# Altium schematic sheet Sheet1.SchDoc
size A2; SheetNumber: 1; SheetTotal: 1
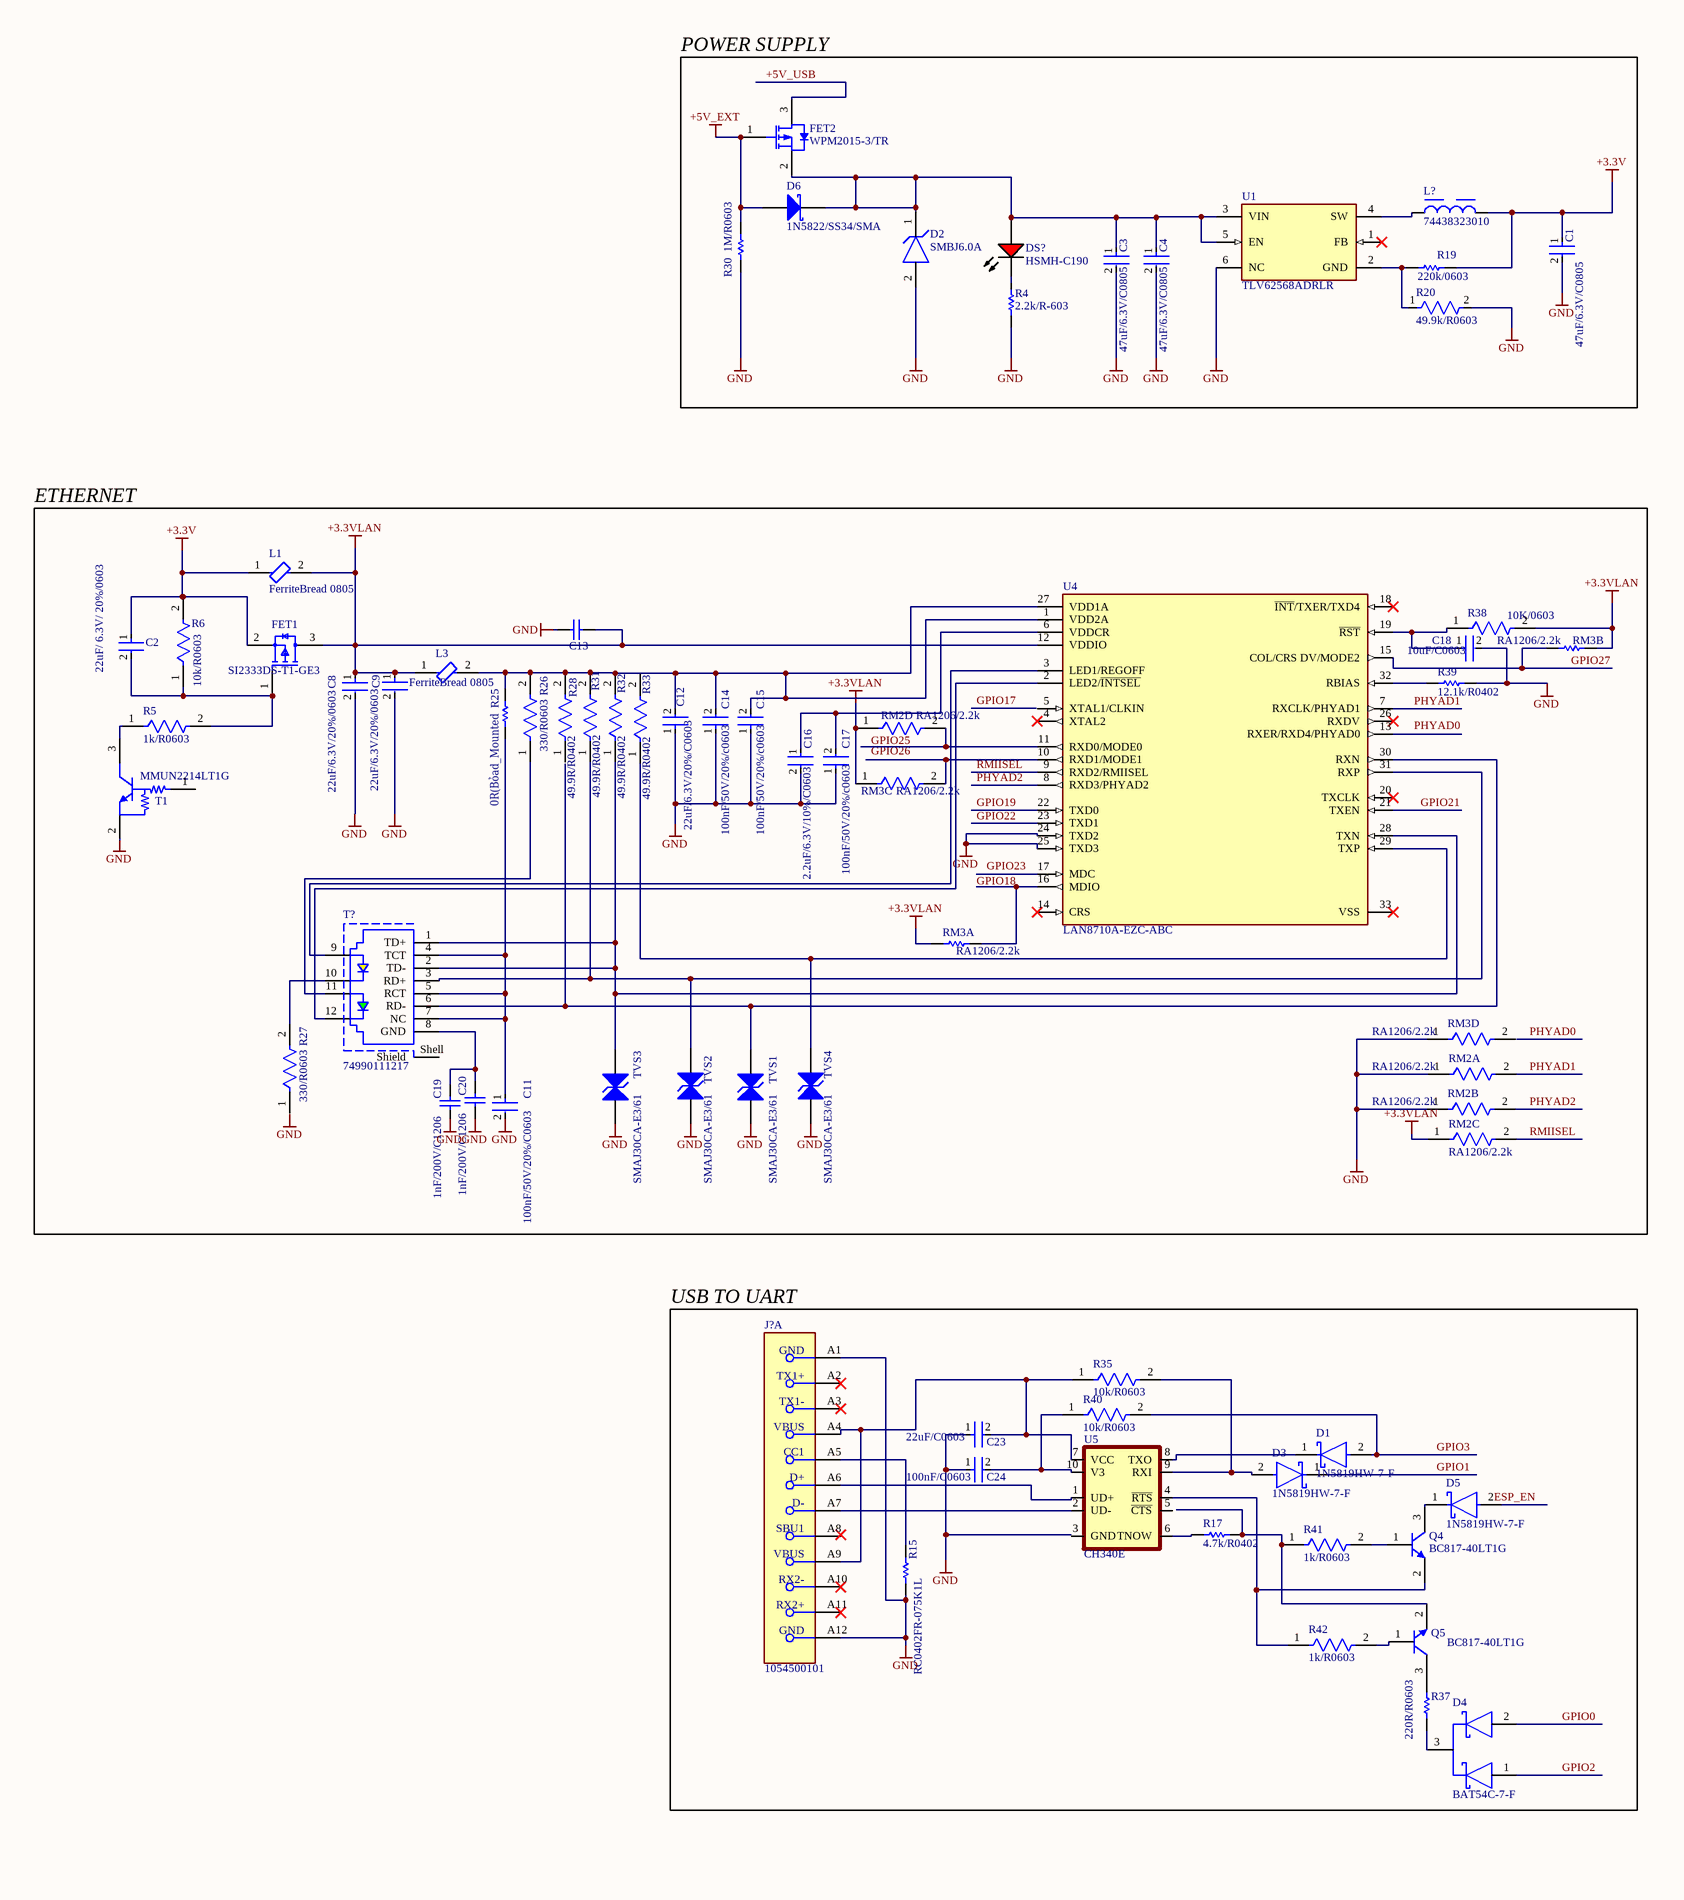
[diagram p0: Sheet1.SchDoc, left]
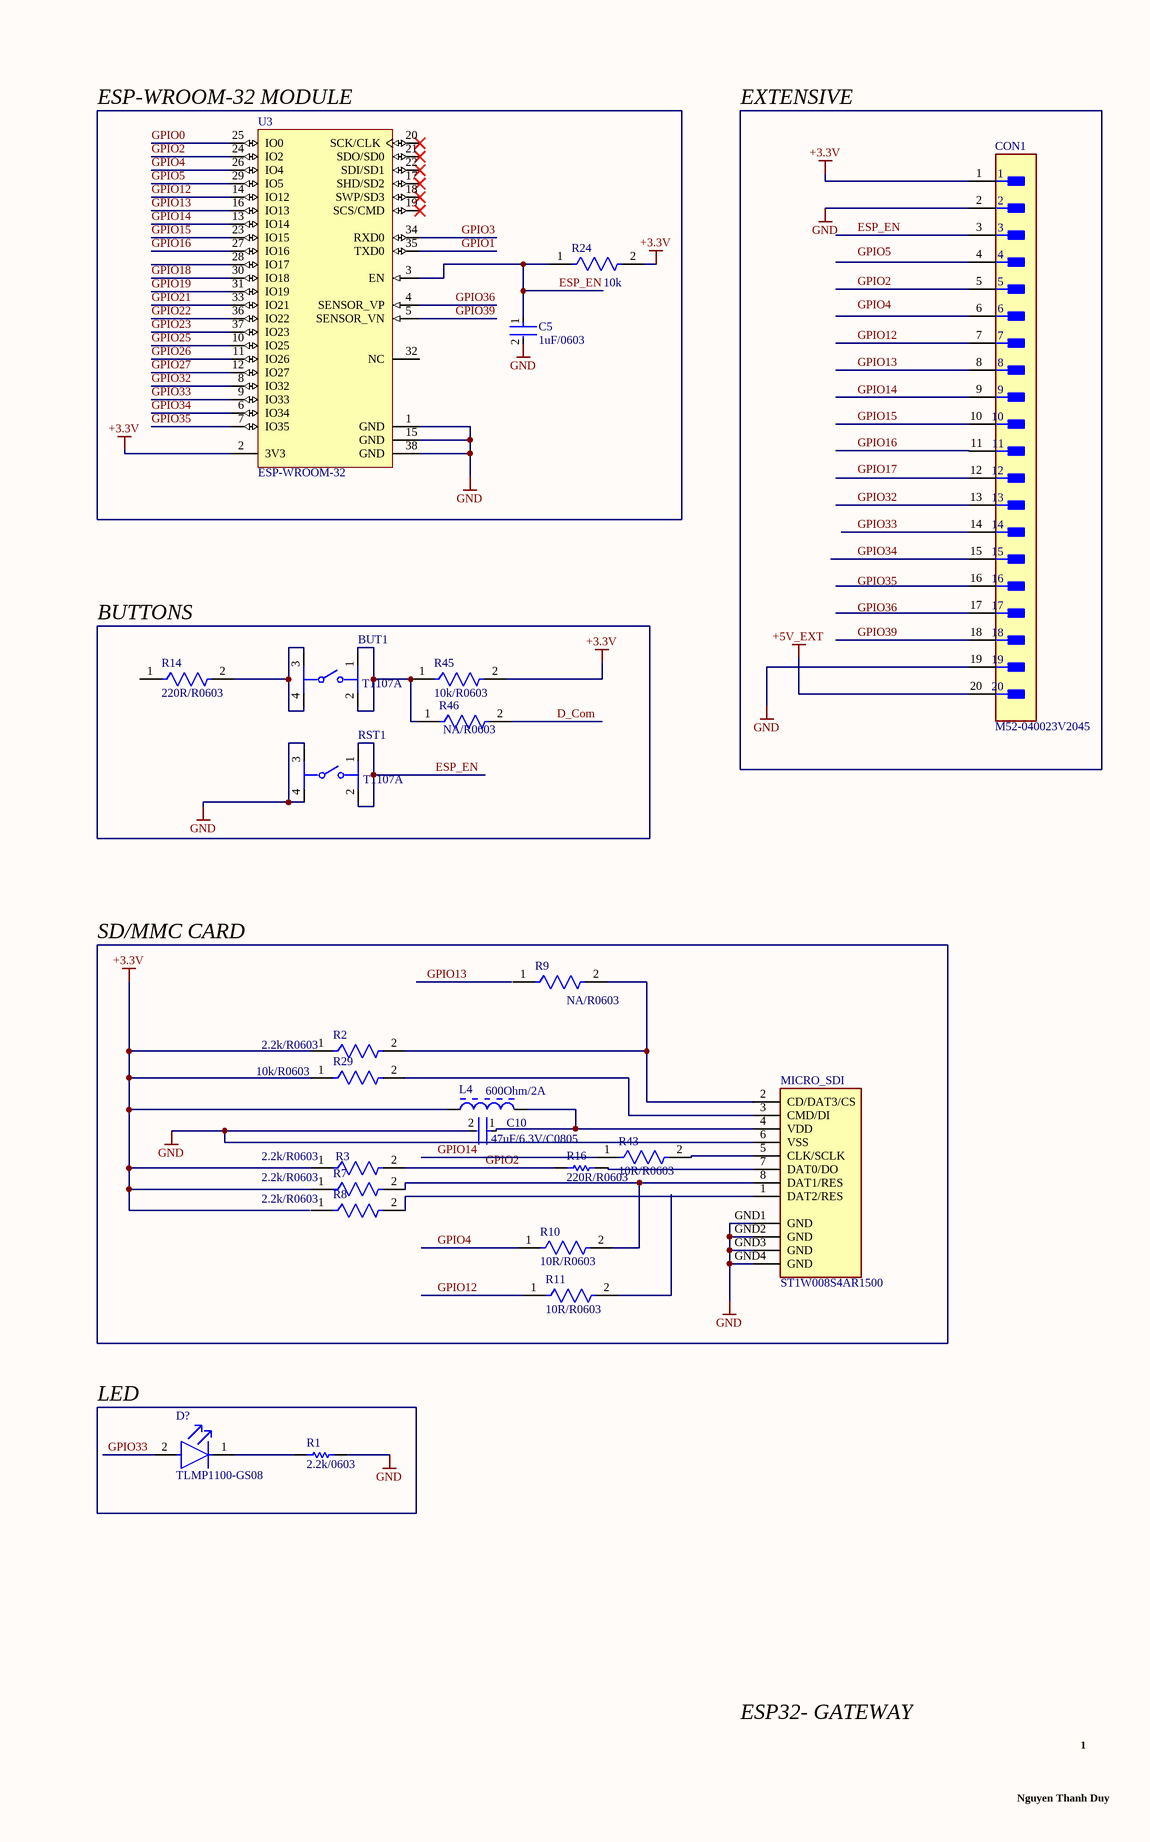
[diagram p1: Sheet1.SchDoc, right]

## Parts
BUT1  T1107A  [FP-PTS645SM43SMTR92LFS-MFG]
C1  47uF/6.3V/C0805  [FP-C0805C476M9PACTU-MFG]
C2  22uF/ 6.3V/ 20%/0603  [FP-GRM21B-0_15-MFG]
C3  47uF/6.3V/C0805  [FP-C0805C476M9PACTU-MFG]
C4  47uF/6.3V/C0805  [FP-C0805C476M9PACTU-MFG]
C5  1uF/0603  [FP-CC0603-DA-MFG]
C8  22uF/6.3V/20%/0603  [FP-GRM188-0_2-IPC_C]
C9  22uF/6.3V/20%/0603  [FP-GRM188-0_2-IPC_C]
C10  47uF/6.3V/C0805  [FP-C0805C476M9PACTU-MFG]
C11  100nF/50V/20%/C0603  [FP-CGA3E-0_3-0_1-IPC_B]
C12  22uF/6.3V/20%/C0603  [FP-GRM188-0_2-IPC_C]
C13  GRM188R71H104KA93D  [CAPC1608X90X35ML10T15]  (value not drawn)
C14  100nF/50V/20%/c0603  [FP-CGA3E-0_3-0_1-IPC_B]
C15  100nF/50V/20%/c0603  [FP-CGA3E-0_3-0_1-IPC_B]
C16  2.2uF/6.3V/10%/C0603  [FP-C0603C225K4PACTU-MFG]
C17  100nF/50V/20%/c0603  [FP-CGA3E-0_3-0_1-IPC_B]
C18  10uF/C0603  [FP-0603-L_1_6_0_15-W_0_81-IPC_C]
C19  1nF/200V/C1206  [AVX-12065C102KAT2A_L]
C20  1nF/200V/C1206  [AVX-12065C102KAT2A_L]
C23  22uF/C0603  [FP-GRM188-0_2-IPC_C]
C24  100nF/C0603  [FP-CGA3E-0_3-0_1-IPC_B]
CON1  M52-040023V2045  [FP-M52-040023V2045-MFG]
D1  1N5819HW-7-F  [FP-SOD123-IPC_A]
D2  SMBJ6.0A  [FP-SMB-MFG]
D3  1N5819HW-7-F  [FP-SOD123-IPC_A]
D4  BAT54C-7-F  [FP-SOT23-IPC_B]
D5  1N5819HW-7-F  [FP-SOD123-IPC_A]
D6  1N5822/SS34/SMA  [MCSM-D-5B-2_L]
D?  TLMP1100-GS08  [FP-6_541-5056_01-4-MFG]
DS?  HSMH-C190  [AVAG-HSMX-C190_V]
FET1  SI2333DS-T1-GE3  [FP-S-03946-MFG]
FET2  WPM2015-3/TR  [AO-SOT-23-3L_V]
J?  1054500101  [FP-1054500101-MFG]  (part A of 3)
L1  FerriteBread 0805  [FP-BLM21-0_2-t0_85-e0_5-d-MFG]
L3  FerriteBread 0805  [FP-BLM21-0_2-t0_85-e0_5-d-MFG]
L4  600Ohm/2A  [LIRD-MI0805K601R-10-2_V]
L?  74438323010  [WE-MAPI_2510]
MICRO_SDI  ST1W008S4AR1500  [JAE_ST1W008S4AR1500]
Q4  BC817-40LT1G  [ONSC-SOT-23-3-318-08_V]
Q5  BC817-40LT1G  [ONSC-SOT-23-3-318-08_V]
R1  2.2k/0603  [RESC1608X55X25LL10T15]
R2  2.2k/R0603  [FP-RC0603-0_55-IPC_C]
R3  2.2k/R0603  [FP-RC0603-0_55-IPC_C]
R4  2.2k/R-603  [RESC1608X55X25LL10T15]
R5  1k/R0603  [FP-ERJ3G-MFG]
R6  10k/R0603  [FP-RC0603-0_55-MFG]
R7  2.2k/R0603  [FP-RC0603-0_55-IPC_C]
R8  2.2k/R0603  [FP-RC0603-0_55-IPC_C]
R9  NA/R0603  [FP-RC0603-0_55-IPC_C]
R10  10R/R0603  [FP-ERJ3EK-MFG]
R11  10R/R0603  [FP-ERJ3EK-MFG]
R14  220R/R0603  [FP-CR0603-MFG]
R15  RC0402FR-075K1L  [RESC1005X40X25NL05T10]
R16  220R/R0603  [RESC1608X55X25LL10T15]
R17  4.7k/R0402  [RESC1005X40X25ML05T05]
R19  220k/0603  [RESC1608X55X25ML10T15]
R20  49.9k/R0603  [FP-ERA6A_L]
R24  10k  [FP-RC0603-0_55-IPC_C]
R25  0R(Bỏad_Mounted  [RESC1005X40X25NL05T10]
R26  330/R0603  [FP-CR0603-IPC_A]
R27  330/R0603  [FP-CR0603-IPC_A]
R28  49.9R/R0402  [FP-ERJ2RK-MFG]
R29  10k/R0603  [FP-RC0603-0_55-IPC_C]
R30  1M/R0603  [RESC1608X55X25ML10T15]
R31  49.9R/R0402  [FP-ERJ2RK-MFG]
R32  49.9R/R0402  [FP-ERJ2RK-MFG]
R33  49.9R/R0402  [FP-ERJ2RK-MFG]
R35  10k/R0603  [FP-RC0603-0_55-MFG]
R37  220R/R0603  [RESC1608X55X25ML10T15]
R38  10K/0603  [FP-RC0603-0_55-MFG]
R39  12.1k/R0402  [RESC1005X40X25LL05T05]
R40  10k/R0603  [FP-RC0603-0_55-MFG]
R41  1k/R0603  [FP-ERA3A-IPC_C]
R42  1k/R0603  [FP-ERA3A-IPC_C]
R43  10R/R0603  [FP-ERJ3EK-MFG]
R45  10k/R0603  [FP-RC0603-0_55-IPC_C]
R46  NA/R0603  [FP-RC0603-0_55-IPC_C]
RM2A  RA1206/2.2k  [FP-AC1206-MFG]
RM2B  RA1206/2.2k  [FP-AC1206-MFG]
RM2C  RA1206/2.2k  [FP-AC1206-MFG]
RM2D  RA1206/2.2k  [FP-AC1206-MFG]
RM3A  RA1206/2.2k  [RESC3116X65X40ML10T20]
RM3B  RA1206/2.2k  [RESC3116X65X40ML10T20]
RM3C  RA1206/2.2k  [FP-AC1206-MFG]
RM3D  RA1206/2.2k  [FP-AC1206-MFG]
RST1  T1107A  [FP-PTS645SM43SMTR92LFS-MFG]
T1  MMUN2214LT1G  [ONSC-SOT-23-3-318-08_V]
T?  74990111217  [74990111217]
TVS1  SMAJ30CA-E3/61  [VISH-DO-214AC-2_L]
TVS2  SMAJ30CA-E3/61  [VISH-DO-214AC-2_L]
TVS3  SMAJ30CA-E3/61  [VISH-DO-214AC-2_L]
TVS4  SMAJ30CA-E3/61  [VISH-DO-214AC-2_L]
U1  TLV62568ADRLR  [FP-DRL0006A-MFG]
U3  ESP-WROOM-32  [OLMX-ESP-WROOM-32]
U4  LAN8710A-EZC-ABC  [FP-32-SQFN-5x5B-0_5P-MFG]
U5  CH340E  [MSOP10]

## Blocks framed on the sheet
POWER SUPPLY: C1 C3 C4 D2 D6 DS? FET2 L? R4 R19 R20 R30 U1
ETHERNET: C2 C8 C9 C11-C20 FET1 L1 L3 R5 R6 R25-R28 R31-R33 R38 R39 RM2A RM2B RM2C RM2D RM3A RM3B RM3C RM3D T1 T? TVS1-TVS4 U4

## Nets
+3.3V: C1.1 C2.1 CON1.1 FET1.2(S) L1.1 L4.1 L?.2 R2.1 R3.1 R6.2 R7.1 R19.2 R24.2 R29.1 R45.2 U3.2(3V3)
+3.3VLAN: C8.1 C9.1 C13.2 FET1.3(D) L1.2 L3.1 R38.2 RM2C.1 RM2D.1 RM3A.1 RM3B.2 RM3C.1 U4.12(VDDIO)
+5V_EXT: CON1.20 D6.1(A) FET2.1(GATE) R30.2
GND: C1.2 C3.2 C4.2 C5.2 C8.2 C9.2 C10.2 C11.2 C12.1 C13.1 C14.1 C15.1 C16.2 C17.1 C18.2 C20.1 C23.1 C24.1 CON1.2 CON1.19 D2.2(A) J?.A1(GND) J?.A12(GND) MICRO_SDI.6(VSS) MICRO_SDI.GND1(GND) MICRO_SDI.GND2(GND) MICRO_SDI.GND3(GND) MICRO_SDI.GND4(GND) R1.2 R4.1 R15.1 R20.2 R30.1 R39.2 RM2A.1 RM2B.1 RM3D.1 RST1.3 RST1.4 T1.2(E) TVS2.1(A1) TVS4.1(A1) U1.6(NC) U3.1(GND) U3.15(GND) U3.38(GND) U4.24(TXD2) U4.25(TXD3)
+5V_USB: FET2.3(DRAIN)
D_Com: R46.2
ESP_EN: C5.1 CON1.3 D5.2(A) R24.1 RST1.1 RST1.2 U3.3(EN)
GPIO0: D4.2(2_ANODE) U3.25(IO0)
GPIO1: D3.1(C) U3.35(TXD0)
GPIO2: CON1.5 D4.1(1_ANODE) R3.2 R16.1 U3.24(IO2)
GPIO3: D1.2(A) R40.2 U3.34(RXD0)
GPIO4: R10.1 U3.26(IO4)
GPIO5: U3.29(IO5)
GPIO12: CON1.7 R11.1 U3.14(IO12)
GPIO13: CON1.8 U3.16(IO13)
GPIO14: CON1.9 R43.1 U3.13(IO14)
GPIO15: CON1.10 U3.23(IO15)
GPIO16: CON1.11 U3.27(IO16)
GPIO18: U3.30(IO18)
GPIO19: U3.31(IO19) U4.22(TXD0)
GPIO21: U3.33(IO21) U4.21(TXEN)
GPIO22: U3.36(IO22) U4.23(TXD1)
GPIO23: U3.37(IO23) U4.17(MDC)
GPIO25: U3.10(IO25)
GPIO26: U3.11(IO26)
GPIO27: RM3B.1 U3.12(IO27) U4.15(COL/CRS_DV/MODE2)
GPIO32: CON1.13 U3.8(IO32)
GPIO33: CON1.14 D?.2(A) U3.9(IO33)
GPIO34: CON1.15 U3.6(IO34)
GPIO35: U3.7(IO35)
GPIO36: U3.4(SENSOR_VP)
GPIO39: CON1.18 U3.5(SENSOR_VN)
PHYAD1: RM2A.2 U4.7(RXCLK/PHYAD1)
PHYAD2: RM2B.2 U4.8(RXD3/PHYAD2)
RMIISEL: RM2C.2 U4.9(RXD2/RMIISEL)
NetBUT1_1: BUT1.1 BUT1.2 R45.1 R46.1
NetBUT1_3: BUT1.3 BUT1.4 R14.2
NetC2_2: C2.2 FET1.1(G) R5.2 R6.1
NetC3_1: C3.1 C4.1 D2.1(C) D6.2(K) DS?.1(A) FET2.2(SOURCE) U1.3(VIN) U1.5(EN)
NetC10_1: C10.1 L4.2 MICRO_SDI.4(VDD)
NetC11_1: C11.1 R25.1 T?.4(TCT) T?.5(RCT) T?.7(NC)
NetC12_2: C12.2 C14.2 C15.2 L3.2 R25.2 R26.2 R28.2 R31.2 R32.2 U4.1(VDD2A) U4.27(VDD1A)
NetC16_1: C16.1 C17.2 U4.6(VDDCR)
NetC18_1: C18.1 R38.1 U4.19(~{RST})
NetC19_2: C19.2 C20.2 T?.8(GND)
NetC23_2: C23.2 J?.A4(VBUS) J?.A9(VBUS) R35.1 U5.7(VCC)
NetC24_2: C24.2 R40.1 U5.10(V3)
NetD1_1: D1.1(C) U5.8(TXO)
NetD3_2: D3.2(A) R35.2 U5.9(RXI)
NetD4_3: D4.3(COMMON_CATHODE) R37.1
NetD5_1: D5.1(C) Q4.3(C)
NetD?_1: D?.1(C) R1.1
NetDS?_2: DS?.2(K) R4.2
NetJ?_A5: J?.A5(CC1) R15.2
NetJ?_A6: J?.A6(D+) U5.1(UD+)
NetJ?_A7: J?.A7(D-) U5.2(UD-)
NetL?_1: L?.1 U1.4(SW)
NetMICRO_SDI_1: MICRO_SDI.1(DAT2/RES) R8.2
NetMICRO_SDI_2: MICRO_SDI.2(CD/DAT3/CS) R2.2 R9.2
NetMICRO_SDI_3: MICRO_SDI.3(CMD/DI) R29.2
NetMICRO_SDI_5: MICRO_SDI.5(CLK/SCLK) R43.2
NetMICRO_SDI_7: MICRO_SDI.7(DAT0/DO) R16.2
NetMICRO_SDI_8: MICRO_SDI.8(DAT1/RES) R7.2 R10.2
NetQ4_1: Q4.1(B) R41.2
NetQ4_2: Q4.2(E) R42.1 U5.4(~{RTS})
NetQ5_1: Q5.1(B) R42.2
NetQ5_2: Q5.2(E) R17.2 R41.1
NetQ5_3: Q5.3(C) R37.2
NetR5_1: R5.1 T1.3(C)
NetR17_1: R17.1 U5.6(TNOW)
NetR19_1: R19.1 R20.1 U1.2(GND)
NetR26_1: R26.1 T?.11
NetR27_2: R27.2 T?.10
NetR31_1: R31.1 T?.3(RD+) TVS2.2(A2) U4.31(RXP)
NetR32_1: R32.1 T?.1(TD+) T?.2(TD-) TVS3.2(A2) U4.28(TXN)
NetR33_1: R33.1 TVS4.2(A2) U4.29(TXP)
NetR39_1: R39.1 U4.32(RBIAS)
NetRM2D_2: RM2D.2 U4.11(RXD0/MODE0)
NetRM3A_2: RM3A.2 U4.16(MDIO)
NetRM3C_2: RM3C.2 U4.10(RXD1/MODE1)
NetT?_6: T?.6(RD-) TVS1.2(A2) U4.30(RXN)
NetT?_9: T?.9 U4.3(LED1/REGOFF)
NetT?_12: T?.12 U4.2(LED2/~{INTSEL})

Not connected (* = marked no-connect by the designer): C19 1; CON1 4 6 12 16 17; J? A2(TX1+)* A3(TX1-)* A8(SBU1) A10(RX2-)* A11(RX2+)*; R8 1; R9 1; R11 2; R14 1; R27 1; R28 1; R33 2; RM3D 2; T1 1(B); T? Shell(Shield); TVS1 1(A1); TVS3 1(A1); U1 1(FB)*; U3 17(SHD/SD2)* 18(SWP/SD3)* 19(SCS/CMD)* 20(SCK/CLK)* 21(SDO/SD0)* 22(SDI/SD1)* 28(IO17) 32(NC); U4 4(XTAL2)* 5(XTAL1/CLKIN) 13(RXER/RXD4/PHYAD0) 14(CRS)* 18(~{INT}/TXER/TXD4)* 20(TXCLK)* 26(RXDV)* 33(VSS)*; U5 3(GND) 5(~{CTS})

## Notes on the sheet
- (near U3) ESP-WROOM-32 MODULE
- EXTENSIVE
- (near R14) BUTTONS
- SD/MMC CARD
- USB TO UART
- LED
- ESP32- GATEWAY
- Nguyen Thanh Duy
- 1
- Labels drawn without touching a wire or pin: GND, GPIO4, GPIO5, GPIO17, GPIO18, GPIO25, GPIO26, GPIO35, GPIO36, PHYAD0

## Library data of the parts
BUT1 RST1 = CMP-2000-05160-2: SWITCH TACTILE SPST-NO 0.05A 12V; Contact Resistance: 100mR; Throw Configuration: SPST; Illumination Type: Non-Illuminated; Mechanical Life: 100000Cycles; Current Rating: 50mA; Switch Function: Off-Mom; Actuator Length: 0.85mm; Actuator Material: Nylon; Actuator Type: Standard; Operating Force: 160gf; Min Operating Temperature: -20°C; REACH SVHC: No SVHC; Termination: Gull Wing; Case/Package: SMD/SMT; Packaging: Tape and Reel; Mount: Surface Mount; Voltage Rating (DC): 12V; Orientation: Straight; Lead Free: Lead Free; Contact Material: Silver; Color: Black; Max Current Rating: 50mA; Contact Plating: Silver; Depth: 9mm; Package Quantity: 1; Max Voltage Rating (DC): 12V; Length: 6mm; Max Operating Temperature: 60°C
C1 C3 C4 C10 = CMP-2007-01008-2: CAP CER 47UF 6.3V X5R 0805; Dielectric Material: Ceramic; Dissipation Factor: 5%; Tolerance: 20%; Case Code (Imperial): 0805; Mount: PCB; Width: 1.2mm; Package Quantity: 3000; Radiation Hardening: No; Packaging: Tape and Reel; Termination: SMD/SMT; Series: C0805C; Voltage: 6.3V; Depth: 1.25mm; Dielectric: X5R; Case Code (Metric): 2012; Length: 2mm; Case/Package: 0805; REACH SVHC: No SVHC; Voltage Rating (DC): 6.3V; Capacitance: 47uF; RoHS Compliant: Yes; Height: 1.25mm; Construction: Flat; Number of Pins: 2; Voltage Rating: 6.3V; Max Operating Temperature: 85°C; Min Operating Temperature: -55°C
C2 = CMP-2007-03385-2: Chip Multilayer Ceramic Capacitors for General Purpose, 0805, 22uF, X5R, 15%, 20%, 6.3V; Material: Ceramic; Max Operating Temperature: 85°C; Voltage: 6.3V; Min Operating Temperature: -55°C; Case/Package: 0805; Thickness: 0.053inch; Dielectric: X5R; Packaging: Tape and Reel; Depth: 1.25mm; Termination: SMD/SMT; Voltage Rating (DC): 6.3V; Radiation Hardening: No; Tolerance: 20%; Mount: Surface Mount; Lead Free: Lead Free; Package Quantity: 1; REACH SVHC: No SVHC; Voltage Rating: 6.3V; Capacitance: 22uF; Length: 2mm; Case Code (Imperial): 0805; Case Code (Metric): 2012; Width: 0.049inch; Height: 1.25mm
C5 = CMP-03422-000924-1: CAP CER 1UF 16V X7R 0603; Manufacturer: YAGEO; Manufacturer Part Number: CC0603KRX7R7BB105; Tolerance: 0.1; Temperature Coefficient: 15%; Material: Ceramic; Package: CC0603-DA; RoHS: TRUE; Device Class L2: Capacitors; Temperature Characteristic: X7R; Temperature: -55°C to +125°C; Temperature Range Low: -55°C; Automotive: No; ComponentLink2Description: Datasheet; Value: 1 uF; Lead Free: Yes; Capacitance: 1 uF; ComponentLink2URL: http://www.yageo.com/documents/recent/UPY-GPHC_X7R_6.3V-to-50V_18.pdf; Device Class L1: Passive Components; Voltage: 16 V; Octopart: https://octopart.com/cc0603krx7r7bb105-yageo-42271928; Category: Cap; Digikey Description: CAP CER 1UF 16V X7R 0603; Footprint Url: http://www.yageo.com/exep/pages/download/literatures/UPY-C_GEN_24.pdf; Height: 0.9mm; Voltage Rating: 16 V; Temperature Range High: +125°C; Mouser Description: Multilayer Ceramic Capacitor, CC Series, 1 - F, - 10%, X7R, 16 V, 0603 [1608 Metric]; Device Class L3: Ceramic Capacitors
C8 C9 C12 C23 = CMP-2000-06337-3: Chip Multilayer Ceramic Capacitors for General Purpose, 0603, 22uF, X5R, 15%, 20%, 10V; Tolerance: 20%; Weight: 0.000222oz; Material: Ceramic; Depth: 0.8mm; Length: 1.6mm; Termination: SMD/SMT; Capacitance: 22uF; Packaging: Tape and Reel; Width: 0.8mm; Voltage Rating: 10V; Case Code (Imperial): 0603; Mount: Surface Mount; Voltage Rating (DC): 10V; Case/Package: 0603; Thickness: 0.039inch; REACH SVHC: No SVHC; Dielectric: X5R; Height: 0.8mm; Package Quantity: 4000; Case Code (Metric): 1608; Min Operating Temperature: -55°C; Lead Free: Lead Free; Max Operating Temperature: 85°C
C11 C14 C15 C17 C24 = CMP-2000-07546-2: Cap Ceramic 100nF 50V X7R 10% Pad SMD 0603 +125°C Automotive T/R; Weight: 7.1E-05oz; Composition: Ceramic; Max Operating Temperature: 125°C; Termination: SMD/SMT; Dielectric: X7R; Length: 1.6mm; Package Quantity: 1; REACH SVHC: No SVHC; Lead Free: Lead Free; Case Code (Metric): 1608; Min Operating Temperature: -55°C; Packaging: Tape and Reel; Tolerance: 10%; Voltage Rating: 50V; Case Code (Imperial): 0603; Capacitance: 100nF; Case/Package: 0603; Voltage Rating (DC): 50V; Depth: 0.8mm; Radiation Hardening: No; Ratings: AEC-Q200; Mount: Surface Mount; Voltage: 50V; Thickness: 0.035inch; Width: 0.8mm; Height: 0.8mm
C13 = CMP-2100-03643-1: Chip Capacitor, 0.1 uF, +/- 10%, 50 V, -55 to 125 degC, 0603 (1608 Metric), RoHS, Tape and Reel; Manufacturer: Murata; Dielectric Material: Ceramic; Voltage Rating: 50V; Capacitance: 100nF; Dielectric: X7R; Insulation Resistance: 10GR; Case Code (Metric): 1608; Lead Free: LeadFree; Depth: 0.8mm; Number of Pins: 2; Radiation Hardening: No; Case/Package: 0603; Manufacturer URL: http://www.murata.com/; Packaging: TapeandReel; Length: 1.6mm; Contact Plating: Tin; Datasheet URL: http://psearch.en.murata.com/capacitor/product/GRM188R71H104KA93%23.pdf; Tolerance: 10%; Case Code (Imperial): 0603; Min Operating Temperature: -55degC; RoHSCompliant: true; Voltage: 50V; Termination: SMD/SMT; Mount: SurfaceMount; Material: Ceramic; Package Quantity: 1; Height: 0.8mm; Thickness: 0.035inch; REACH SVHC: NoSVHC; Max Operating Temperature: 125degC; Width: 0.8mm; Package Reference: 0603; Voltage Rating (DC): 50V; Datasheet Version: 42675.0; Package Description: 2-Pin Surface Mount Device, Body 1.6 x 0.8 mm
C16 = CMP-2006-02259-2: CAP CER 2.2UF 16V X5R 0603; Dielectric Material: Ceramic; Tolerance: 10%; Dissipation Factor: 5%; Series: C; Voltage Rating (DC): 16V; REACH SVHC: No SVHC; RoHS Compliant: Yes; Number of Pins: 2; Max Operating Temperature: 85°C; Voltage Rating: 16V; Min Operating Temperature: -55°C; Termination: SMD/SMT; Dielectric: X5R; Packaging: Tape and Reel; Contact Plating: Tin; Case Code (Metric): 1608; Height: 0.8mm; Capacitance: 2.2uF; Case/Package: 0603; Width: 0.8mm; Construction: Flat; Depth: 0.8mm; Thickness: 0.034inch; Radiation Hardening: No; Length: 1.6mm; Mount: Surface Mount; Case Code (Imperial): 0603; Voltage: 16V; Package Quantity: 1; Lead Free: Lead Free
C18 = CMP-2006-04476-2: General Purpose Ceramic Capacitor, 0603, 10uF, 20%, X5R, 15%, 6.3V; RoHS Compliant: Yes; Case Code (Imperial): 0603; Construction: Flat; Thickness: 0.035inch; Height: 0.9mm; Number of Pins: 2; Max Operating Temperature: 85°C; Capacitance: 10uF; Length: 1.6mm; REACH SVHC: No SVHC; Width: 0.032inch; Voltage Rating (DC): 6.3V; Termination: SMD/SMT; Contact Plating: Tin; Min Operating Temperature: -55°C; Depth: 0.81mm; Packaging: Tape and Reel; Case Code (Metric): 1608; Voltage Rating: 6.3V; Lead Free: Lead Free; Mount: Surface Mount; Radiation Hardening: No; Series: -; Dielectric Material: Ceramic; Package Quantity: 1; Case/Package: 0603; Tolerance: 20%; Dielectric: X5R; Voltage: 6.3V
C19 C20 = CMP-2000-05865-1: Chip Capacitor, 1 nF, +/- 10%, 50 V, -55 to 125 degC, 1206 (3216 Metric), RoHS, Tape and Reel; Manufacturer: AVX; Rated Voltage: 50V; Capacitance: 1nF; Dielectric: X7R; Datasheet Version: 07/2016; Manufacturer URL: http://www.avx.com/; Package Description: 2-Pin Surface Mount Device, Body 3.2 x 1.6 mm; Datasheet URL: http://datasheets.avx.com/X7RDielectric.pdf; Mounting Technology: SurfaceMount; Case Size/Dimension: 1206; Package Reference: 1206; Tolerance (%): ±10%
CON1 = CMP-15831-000096-1: CONN HEADER VERT 20POS 1.27MM; Voltage Rating: 500V; Contact Resistance: 30mR; Number of Contacts: 20; Insulation Resistance: 1GR; Mated Stacking Heights: 11mm; Max Current Rating: 1A; Gender: Male; Depth: 2.5mm; Pitch: 1.27mm; Contact Gender: Male; Insulation Material: Nylon; Length: 25.4mm; Contact Type: Male Pin; Min Operating Temperature: -40°C; Mount: Through Hole; Max Operating Temperature: 105°C; Connector Type: Header; Termination: Solder; Number of Rows: 1; Package Quantity: 300; Contact Material: Brass; Orientation: Straight; Flammability Rating: UL94 V-0; Series: M52; Current Rating: 1A; Housing Color: Black; Housing Material: Nylon; Insulation Color: Black; Case/Package: SIL; Number of Positions: 20; Reach SVHC Compliant: Yes; Packaging: Bulk; Contact Finish - Mating: GOLD; Fastening Type: Pull; Contact Plating: Gold; Contact Shape: Square
D1 D3 D5 = CMP-0303-00003-3: DIODE SCHOTTKY 40V 1A SOD123; Forward Voltage: 450mV; Capacitance: 110pF; Max Forward Surge Current (Ifsm): 25A; Peak Reverse Current: 50uA; Polarity: Standard; Element Configuration: Single; Max Power Dissipation: 450mW; Min Operating Temperature: -65°C; Package Quantity: 3000; Contact Plating: Tin; Weight: 0.000353oz; Max Repetitive Reverse Voltage (Vrrm): 40V; Max Reverse Voltage (DC): 40V; Height: 1.25mm; Average Rectified Current: 1A; Width: 1.7mm; Case/Package: SOD-123-2; Lead Free: Lead Free; Max Operating Temperature: 125°C; Current Rating: 1A; Termination: SMD/SMT; Forward Current: 1A; Radiation Hardening: No; Number of Pins: 2; Length: 2.85mm; Voltage Rating (DC): 40V; REACH SVHC: No SVHC; Peak Non-Repetitive Surge Current: 25A; Packaging: Tape and Reel; Output Current: 1A
D2 = CMP-12828-000017-1: TVS DIODE 5V 9.2V SMB; Manufacturer: Diodes Inc; Manufacturer Part Number: SMBJ5.0A-13-F; Number Of Channels: 1; Peak Pulse Current: 65.2A; Max Junction Temp: +150°C; Standoff Height: 0.05mm; Peak Pulse Power: 600W; Direction: Unidirectional; Breakdown Voltage: 6.4V; Temperature: -55°C to +150°C; Package: SMB; Automotive: No; Footprint Url: https://www.diodes.com/assets/Package-Files/SMB.pdf; Octopart: https://octopart.com/smbj5.0a-13-f-diodes+inc.-350946; Digikey Description: TVS DIODE 5V 9.2V SMB; Clamping Voltage: 9.2V; Reverse Standoff Voltage: 5V; Device Class L2: TVS Diodes; RoHS: TRUE; Device Class L1: Circuit Protection; ComponentLink2URL: https://www.diodes.com/assets/Datasheets/ds19002.pdf; Mouser Description: TVS Diodes - Transient Voltage Suppressors 600W 5.0V; Lead Free: Yes; Device Class L3: unset; Temperature Range High: +150°C; Temperature Range Low: -55°C; Category: Diode; ComponentLink2Description: Datasheet; Height: 2.5mm
D4 = CMP-12790-000084-1: DIODE ARRAY SCHOTTKY 30V SOT23-3; Max Reverse Current: 2uA; Power Dissipation: 200mW; Average Rectified Current: 200mA; Capacitance: 10pF; Peak Non-Repetitive Surge Current: 600mA; Forward Voltage: 800mV; Reverse Recovery Time: 5ns; Element Configuration: Common Cathode; Max Operating Temperature: 150°C; Max Reverse Voltage (DC): 30V; Power Rating: 200mW; Termination: SMD/SMT; REACH SVHC: No SVHC; Voltage Rating (DC): 30V; Series: -; Current Rating: 200mA; RoHS Compliant: Yes; Max Power Dissipation: 200mW; Case/Package: SOT-23; Max Repetitive Reverse Voltage (Vrrm): 30V; Width: 1.3mm; Min Operating Temperature: -65°C; Lead Free: Lead Free; Forward Current: 200mA; Number of Pins: 3; Contact Plating: Tin; Package Quantity: 3000; Length: 2.9mm; Radiation Hardening: No; Max Forward Surge Current (Ifsm): 600mA; Height: 1mm; Packaging: Tape and Reel; Mount: Surface Mount; Weight: 0.000282oz
D6 = CMP-2000-07610-1: Schottky Barrier Rectifier, 3 A, 0.4 V, -65 to 150 degC, 2-Pin MELF (D-5B), Bulk; Manufacturer: MicrosemiCorporation; Current - Reverse Leakage @ Vr: 100mA@40V; Speed: FastRecovery=200mA(Io); Voltage - DC Reverse (Vr) (Max): 40V; Voltage - Forward (Vf) (Max) @ If: 500mV@3A; Current - Average Rectified (Io): 3A; Family: Diodes-Rectifiers-Single; Datasheet Version: Rev. 1, 06/2013; Supplier Device Package: B,SQ-MELF; Series: -; Part Status: Active; Diode Type: Schottky; Package Reference: D-5B-2; Operating Temperature - Junction: -65°C~125°C; Reverse Recovery Time (trr): -; Package / Case: SQ-MELF,B; Mounting Type: SurfaceMount; Datasheet URL: https://www.microsemi.com/document-portal/doc_download/131998-lds-0303-1; Packaging: Bulk; Package Description: 2-Pin Surface Mount Device, Body 5.4 x 3.62 mm; Manufacturer URL: http://www.microsemi.com/; Category: DiscreteSemiconductorProducts; Capacitance @ Vr, F: -
D? = CMP-02520-000009-1: LED GREEN 0603 SMD; Manufacturer: Vishay; Description: Green 561nm LED Indication - Discrete 2.1V 0603 (1608 Metric); Max Junction Temp: +120°C; Automotive Grade: Grade 3; Reverse Voltage: 6V; Led Orientation: Top View; Forward Voltage: 2.1V; Luminous Intensity: 15mcd; Forward Current: 20mA; Colour: Pure green; Peak Emmision Wavelength: 562nm; Wavelength: 561nm; Viewing Angle: 160°; Power Dissipation: 90mW; Digikey Description: LED GREEN 0603 SMD; Package: 6.541-5056.01-4; Ambient Temperature Range High: +100°C; Height: 0.65mm; Device Class L1: Optoelectronics; Device Class L2: LEDs; Mouser Description: Standard LEDs - SMD Pure Green; Temperature Range High: +120°C; RoHS: TRUE; Ambient Temperature Range Low: -40°C; Temperature: to +120°C; Manufacturer Part Number: TLMP1100-GS08; ComponentLink2URL: http://www.vishay.com/docs/83173/tlmb1100.pdf; Lead Free: Yes; Octopart: https://octopart.com/tlmp1100-gs08-vishay-55433993; Automotive: Yes; Device Class L3: unset; ComponentLink2Description: Datasheet; Category: Diode
DS? = CMP-1744-00004-1: LED Uni-Color Red, 65 mW, 20 mA, -40 to 85 degC, 2-Pin SMD, RoHS, Tape and Reel; Connector Type: USB; Gender: Male; Current Rating: 1 A; Length: 7.5 mm; Lead Pitch: 0.65 mm; PackageReference: HSMX-C190; Package Quantity: 2000; Max Operating Temperature: 85 degC; PackageDescription: 2-Pin Surface Mount Device, Body 1.6 x 0.8 mm, Height 0.9 mm; ComponentLink3Description: Package Specification; Mount: Surface Mount; Min Operating Temperature: -30 degC; ComponentLink3URL: http://www.fairchildsemi.com/dwg/MA/MA03D.pdf; ComponentLink1Description: Manufacturer URL; Contact Material: Copper; Pins: 5; Width: 5.6 mm; ComponentLink2Description: Datasheet; RoHSCompliant: true; DatasheetVersion: Mar-12; Height: 2.8 mm; Packaging: Tape and Reel; Contact Plating: Gold; ComponentLink1URL: http://www.avagotech.com/; REACH SVHC: No SVHC; ComponentLink2URL: http://docs.avagotech.com/docs/AV02-0551EN
FET1 = CMP-00030-44342535-1: SI2333DS-T1-GE3 Transistor: P-MOSFET; unipolar; -12V; -5.3A; 0.032ohm; 1.25W; -55+150 deg.C; SMD; SOT23; Max Power Dissipation: 750mW; Input Capacitance: 1.1nF; Nominal Vgs: -1V; Element Configuration: Single; Continuous Drain Current (ID): 4.1A; Gate to Source Voltage (Vgs): 8V; Turn-On Delay Time: 25ns; Rds On Max: 32mΩ; Turn-Off Delay Time: 72ns; Number of Channels: 1; Fall Time: 60ns; RoHS: Compliant; Drain to Source Voltage (Vdss): -12V; Min Operating Temperature: -55°C; Threshold Voltage: -1V; NexarPartId: 44342535; Weight: 1.437803g; Number of Pins: 3; Max Operating Temperature: 150°C; REACH SVHC: Unknown; Radiation Hardening: No; Case/Package: SOT-23-3; Drain to Source Resistance: 32mΩ; Mount: Surface Mount
FET2 = CMP-2000-05778-1: P-Channel MOSFET, 30 V, 4 A, -55 to 150 degC, 3-Pin SOT-23-3L, RoHS, Tape and Reel; Manufacturer: Alpha and Omega; Output Power (Max): NotRequiredW; Power Dissipation: 1.4W; Rad Hardened: No; Drain Efficiency: NotRequired%; Drain-Source On-Volt: 30V; Noise Figure: NotRequireddB; Frequency (Max): NotRequiredMHz; Number of  Elements: 1; Gate-Source Voltage (Max): ?12V; Drain Current (Max): 4A; Channel Mode: Enhancement; Drain-Source On-Res: 0.044ohm; Polarity: P; Package URL: http://www.aosmd.com/res/packaging_information/SOT-23-3L.pdf; Datasheet URL: http://www.aosmd.com/res/data_sheets/AO3401A.pdf; Package Type: SOT-23; Package Description: 3-Pin Small Outline Transistor, Body 2.95 x 1.6 mm, Pitch 0.95 mm; Mounting: SurfaceMount; Manufacturer URL: http://www.aosmd.com/; Continuous Drain Current: 4A; Type: PowerMOSFET; Package Reference: SOT-23-3L; Mounting Technology: SurfaceMount; Operating Temperature Classification: Military; Power Gain: NotRequireddB; Datasheet Version: Rev. 3, 03/2011; Operating Temp Range: -55Cto150C; Pin Count: 3
J? = CMP-04767-000004-1: CONN RCP USB3.1 TYPEC 24P SMD RA; Manufacturer: Molex; Number Of Contacts: 24; Voltage Rating: 30V; Shielding: true; Is Female: yes; Current Rating: 0.25/1.25/5A; Pitch: 0.5mm; Conn Orientation: Right Angle; Package: 0; Height: 3.44mm; Footprint Url: https://www.molex.com/pdm_docs/sd/1054500101_sd.pdf; Device Class L1: Connectors; Category: Conn; Device Class L2: USB Connectors; Digikey Description: CONN RCP USB3.1 TYPEC 24P SMD RA; Contact Material: Gold,Nickel; Mouser Description: USB Shielded I/O Receptacle; Type C; Right Angle; Surface Mount; Gold over Nickel; ComponentLink2Description: Datasheet; Lead Free: Yes; Automotive: No; Temperature Range High: +85°C; RoHS: TRUE; Octopart: https://octopart.com/105450-0101-molex-68082325; ComponentLink2URL: https://www.molex.com/webdocs/datasheets/pdf/en-us/1054500101_IO_CONNECTORS.pdf; Temperature: -30°C to +85°C; Usb Standard: USB 3.1; Temperature Range Low: -30°C; Device Class L3: unset; Manufacturer Part Number: 1054500101
L1 L3 = CMP-0686-00616-3: Chip Ferrite Bead, 0805, 60Ω @ 100MHz, 0.02Ω, 25%, 3.5A; DC Resistance-Max: 20mR; Number of Circuits: 1; Impedance: 60R; DC Current: 3A; Shielding: Unshielded; Material: Steel; Military Standard: Not; DC Resistance (DCR): 20mR; Core Material: Ferrite; Termination: SMD/SMT; Max Operating Temperature: 125°C; Max Current Rating: 3.5A; Length: 2mm; Packaging: Tape and Reel; Case Code (Metric): 2012; Series: BLM21P; REACH SVHC: No SVHC; Width: 1.25mm; Current Rating: 3.5A; Height: 0.85mm; RoHS Compliant: Yes; Case Code (Imperial): 0805; Radiation Hardening: No; Frequency: 100MHz; Package Quantity: 1; Depth: 1.25mm; Tolerance: 25%; Number of Lines: 1; Lead Free: Lead Free; Case/Package: 0805; Min Operating Temperature: -55°C; Max DC Current: 3A; Number of Pins: 2; Test Frequency: 100MHz
L4 = CMP-2000-05196-1: Chip Bead for Power Filtering, 1500 mA, 600 Ohm, -40 to 125 degC, 0805 (2012 Metric), RoHS, Tape and Reel; Manufacturer: Laird; Filter Type: PowerLine; Current Rating (Max): 1.5A; Catalog Drawings: (HI,HZ,LI,MI)0805Series_1.10mmMax.Height; Impedance @ Frequency: 600Ohm@100MHz; Number of Lines: 1; DC Resistance (DCR) (Max): 100mOhm; Other Names: 240-2390-1; Kits: 240-2227-ND-KITEMIFERRITEBEADCHIPSMD; Online Catalog: MISeries; Standard Package: 1; Datasheet Version: Rev. A, 01/2004; Height (Max): 0.043"(1.10mm); Category: Filters; Operating Temperature: -40degC~125degC; Package Description: 2-Pin Surface Mount Device, Body 2 x 1.25 mm; Package / Case: 0805(2012Metric); Package Reference: MI0805K601R-10-2; Packaging: CutTape(CT); Ratings: -; Mounting Type: SurfaceMount; Datasheet URL: https://datasheet.ciiva.com/3082/mi0805k601r-10-a-vp-3082219.pdf; Size / Dimension: 0.079"Lx0.049"W(2.00mmx1.25mm); Family: FerriteBeadsandChips; Manufacturer URL: https://www.lairdtech.com; Series: MI
L? = CMP-1411-00009-3: NexarPartId: 30848142; Core Material: Composite, Ferrite, Metal; Series Resistance: 63mΩ; Inductance: 1µH; Tolerance: 20%; RMS Current (Irms): 2.5A; Self Resonant Frequency: 80MHz; Shielding: Shielded; Saturation Current: 4A; Test Frequency: 100kHz; Ambient Temperature Range High: 85°C; Packaging: Cut Tape (CT); Height: 1mm; Max Operating Temperature: 125°C; Length: 2.5mm; Height - Seated (Max): 990.6µm; Mount: Surface Mount; Depth: 2mm; DC Resistance (DCR): 63mΩ; Case/Package: 1008; REACH SVHC: Unknown; Termination: SMD/SMT; Weight: 32.006612mg; Ambient Temperature Range Low: -40°C; RoHS: Compliant; Max DC Current: 2.5A; Case Code (Imperial): 1008; Number of Pins: 2; Width: 2mm; Case Code (Metric): 2520; Current Rating: 2.5A; Inductance Tolerance: 20%; Min Operating Temperature: -40°C
MICRO_SDI = ST1W008S4AR1500: 8 Position Card Connector Secure Digital - microSDâ„¢ Surface Mount, Right Angle Gold; MF: JAE Electronics; SnapEDA_Link: https://www.snapeda.com/parts/ST1W008S4AR1500/JAE%20Electronics/view-part/423641/?ref=snap; Price: None; MP: ST1W008S4AR1500; Value: *; Availability: Warning; Purchase-URL: https://pricing.snapeda.com/search/part/ST1W008S4AR1500/?ref=eda; Package: None; Check_prices: https://www.snapeda.com/parts/ST1W008S4AR1500/JAE%20Electronics/view-part/423641/?ref=eda
Q4 Q5 = CMP-1048-00019-1: General Purpose Transistor, NPN Silicon, 3-Pin SOT-23, Pb-Free, Tape and Reel; Manufacturer: On Semiconductor; fT Min (MHz): 100; IC Continuous (A): 0.5; ComponentLink2URL: http://www.onsemi.com/pub_link/Collateral/BC817-16LT1-D.PDF; DatasheetVersion: Rev. 12; ComponentLink3URL: http://www.onsemi.cn/pub_link/Collateral/318-08.PDF; ComponentLink3Description: Package Specification; ComponentLink1Description: Manufacturer URL; Mounting Technology: Surface Mount; ComponentLink1URL: http://www.onsemi.com/; Packing: Tape and Reel; ComponentLink2Description: Datasheet; Polarity: NPN; RoHS: TRUE; PackageVersion: Rev. AP, 11/2009; PartNumber: BC817-40LT1G; PackageDescription: 3-Pin Small Outline Transistor, Body 2.92 x 1.3 mm, Pitch 0.95 mm; PackageReference: SOT-23-3-318-08
R1 R4 = CMP-2000-06934-1: Thick Film Resistor, 2.2 KOhm, 100 mW, 50 V, +/- 1%, -55 to 155 degC, 2-Pin SMD (0603), RoHS, Tape and Reel; Manufacturer: Yageo; Resistance: 2.2kOhms; Temperature Coefficient: 100PPM/C; Voltage Rating: 50V; Power Rating: 100mW; Tolerance: 1%; Datasheet Version: Rev. 7, 05/2017; Case Code - mm: 1608; Series: RC; Mounting Technology: SurfaceMount; Package Description: 2-Pin Surface Mount Device, Body 1.6 x 0.8 mm; Case Code - in: 0603; Package Reference: 0603; Product: ThickFilmResistorsGeneralPurpose; Manufacturer URL: http://www.yageo.com/; Termination Style: SMD/SMT; Operating Temperature Range: -55Cto+155C; Datasheet URL: http://www.yageo.com/documents/recent/PYu-RC_Group_51_RoHS_L_7.pdf; Packaging: Reel
R2 R3 R6-R9 R24 R29 R35 R38 R40 R45 R46 = CMP-2100-03664-2: RES 10K OHM 1% 1/10W 0603; Voltage Rating: 75V; Voltage Rating (DC): 50V; Resistance: 10kR; Power Rating: 100mW; Temperature Coefficient: 100ppm/°C; Depth: 0.8mm; Termination: SMD/SMT; Resistor Type: Thick Film; Series: RC; Construction: Rectangular; Features: Moisture Resistant; Packaging: Tape and Reel; Min Operating Temperature: -55°C; Number of Terminations: 2; Lead Pitch: 0.3mm; RoHS Compliant: Yes; Case/Package: 0603; Resistance Tolerance: 1%; Military Standard: Not; Weight: 7.1E-05oz; Number of Pins: 2; Tolerance: 1%; Length: 1.6mm; Case Code (Imperial): 0603; Lead Free: Lead Free; Width: 0.8mm; Max Power Dissipation: 100mW; Height: 0.45mm; Max Operating Temperature: 155°C; Case Code (Metric): 1608; Size Code: 0603
R5 = CMP-2000-00703-2: RES SMD 1K OHM 5% 1/10W 0603; Manufacturer: Panasonic; Manufacturer Part Number: ERJ-3GEYJ102V; Resistance: 1000Ω; Voltage: 75 V; Power Rating: 0.1W; Temperature Coefficient: 200ppm/°C; Voltage Rating: 75V; Value: 1000Ω; Automotive Grade: Grade 0; Category: Res; Ipc Land Pattern Name: RESC16080X45; Mounting Type: surface mount; Octopart: https://octopart.com/erj-3geyj102v-panasonic-55403670; Automotive: Yes; Temperature: -55°C to +155°C; ComponentLink2Description: Datasheet; Lead Free: Yes; Footprint Url: https://industrial.panasonic.com/cdbs/www-data/pdf/RDA0000/DMA0000COL17.pdf; Tolerance: 5%; Device Class L1: Passive Components; Height: 0.55mm; Temperature Range Low: -55°C; RoHS: TRUE; Package: ERJ3G; ComponentLink2URL: https://industrial.panasonic.com/cdbs/www-data/pdf/RDA0000/AOA0000C301.pdf; Temperature Range High: +155°C; Digikey Description: RES SMD 1K OHM 5% 1/10W 0603; Series: ERJ; Device Class L2: Resistors; Device Class L3: Chip SMD Resistors; Mouser Description: Res Thick Film 0603 1K Ohm 5% 1/10W ±200ppm/°C Molded SMD Punched Carrier T/R; Composition: Thick Film
R10 R11 R43 = CMP-2000-00195-2: RES SMD 10 OHM 1% 1/10W 0603; Manufacturer Part Number: ERJ-3EKF10R0V; Manufacturer: Panasonic; Resistance: 10Ω; Voltage Rating: 75V; Value: 10Ω; Power: 100mW; Power Rating: 0.1W; Temperature Coefficient: 100ppm/°C; Automotive Grade: Grade 0; Lead Free: Yes; Device Class L1: Passive Components; Digikey Description: RES SMD 10 OHM 1% 1/10W 0603; Octopart: https://octopart.com/erj-3ekf10r0v-panasonic-55403649; Automotive: Yes; ComponentLink2URL: https://b2b-api.panasonic.eu/file_stream/pids/fileversion/1263; Height: 0.55mm; Temperature Range High: +155°C; Footprint Url: https://industrial.panasonic.com/cdbs/www-data/pdf/RDA0000/DMA0000COL17.pdf; Temperature: -55°C to +155°C; Tolerance: 1%; ComponentLink2Description: Datasheet; Package: ERJ3EK; Device Class L2: Resistors; Category: Res; Ipc Land Pattern Name: RESC16080X45; RoHS: TRUE; Composition: Thick Film; Device Class L3: Chip SMD Resistors; Temperature Range Low: -55°C; Series: ERJ
R14 = CMP-07231-000397-1: Thick Film Chip Resistors 0603 220Ω 0.1W 5% 200ppm/°C; Power Rating: 100mW; Voltage Rating: 50V; Resistance: 220R; Min Operating Temperature: -55°C; Case/Package: 0603; Case Code (Imperial): 0603; Packaging: Tape and Reel; Case Code (Metric): 1608; Temperature Coefficient: 200ppm/°C; Length: 1.6mm; Max Operating Temperature: 155°C; Military Standard: Not; Width: 0.8mm; Tolerance: 5%; Depth: 0.8mm; Contact Plating: Tin; Package Quantity: 5000; Mount: Surface Mount; Termination: SMD/SMT; Radiation Hardening: No; Height: 0.45mm; Composition: Thick Film; Thickness: 457um
R15 = CMP-2002-07753-1: Manufacturer: Yageo / Phycomp; Part Number: RC0402FR-075K1L
R16 = CMP-1012-00058-2: Chip Resistor, 220 Ohm, +/- 5%, 0.1 W, -55 to 155 degC, 0603 (1608 Metric), RoHS, Tape and Reel; Manufacturer: Yageo; Temperature Coefficient: 100PPM/C; Voltage Rating: 50V; Resistance: 220Ohms; Power Rating: 100mW; Mounting Technology: SurfaceMount; Tolerance: 5%; Datasheet URL: http://www.yageo.com/documents/recent/PYu-RC_Group_51_RoHS_L_7.pdf; Operating Temperature Range: -55Cto+155C; Packaging: Reel; Package Description: 2-Pin Surface Mount Device, Body 1.6 x 0.8 mm; Termination Style: SMD/SMT; Datasheet Version: Rev. 7, 05/2017; Product: ThickFilmResistorsGeneralPurpose; Package Reference: 0603; Case Code - in: 0603; Manufacturer URL: http://www.yageo.com/; Case Code - mm: 1608; Series: RC
R17 = CMP-2002-01154-4: Chip Resistor, 4.7 KOhm, +/- 1%, 0.1 W, -55 to 155 degC, 0402 (1005 Metric), RoHS, Tape and Reel; PartNumber: ERJ-2RKF4701X; Voltage Rating: 50 V; Case\/Package: 0402; Power Rating: 100 mW; Height: 0.35 mm; Mounting Technology: Surface Mount; REACH SVHC: Yes; Resistance: 4.7 KOhm; Max Operating Temperature: 155 degC; ComponentLink1Description: Manufacturer URL; ComponentLink2Description: Datasheet; Pins: 2; PackageReference: 0402; Tolerance: 1%; Case Code (Imperial): 0402; Length: 1 mm; PackageDescription: 2-Pin Surface Mount Device, Body 1 x 0.5 mm; RoHSCompliant: true; Package Quantity: 1; Radiation Hardening: No; DatasheetVersion: 04/2015; Width: 0.5 mm; Case Code (Metric): 1005; Mount: Surface Mount; ComponentLink1URL: http://www.panasonic.com/; Min Operating Temperature: -55 degC; Packaging: Cut Tape; ComponentLink2URL: http://industrial.panasonic.com/cdbs/www-data/pdf/RDA0000/AOA0000C86.pdf
R19 = CMP-1659-00037-1: Chip Resistor, 220 KOhm, +/- 1%, 100 mW, -55 to 155 degC, 0603 (1608 Metric), RoHS, Tape and Reel; Resistance: 0.1 Ohm; ComponentLink1Description: Manufacturer URL; ComponentLink2Description: Datasheet; ComponentLink1URL: http://www.yageo.com/; REACH SVHC: No SVHC; RoHSCompliant: true; DatasheetVersion: Rev. 4, 02/2016; Min Operating Temperature: -25 degC; Height: 0.25 inch; ComponentLink2URL: http://www.yageo.com/documents/recent/PYu-RC_Group_51_RoHS_L_04.pdf; PackageDescription: 2-Pin Surface Mount Device, Body 1.6 x 0.8 mm; Max Operating Temperature: 70 degC; Width: 0.25 inch; Length: 0.75 inch; PackageReference: 0603
R20 = CMP-2001-00839-2: Res Thin Film 0805 49.9K Ohm 0.1% 0.125W(1/8W) +/-25ppm/ßC SMD Automotive T/R; Power Rating: 125mW; Resistance: 49.9kΩ; Temperature Coefficient: 25ppm/°C; Voltage Rating (DC): 100V; Weight: 5.499807mg; Lead Free: Lead Free; Max Operating Temperature: 155°C; Number of Terminations: 2; Case Code (Metric): 2012; Case/Package: 0805; Lifecycle Status: Production; Case Code (Imperial): 0805; Composition: Metal Film, Thin Film; RoHS: Compliant; Features: Automotive AEC-Q200; Radiation Hardening: No; Termination: SMD/SMT; Depth: 1.25mm; Mount: Surface Mount; Number of Pins: 2; Contact Plating: Tin; Min Operating Temperature: -55°C; REACH SVHC: Unknown; Tolerance: 0.1%; Length: 2mm; Height: 500µm; Schedule B: 8533210045, 8533210045; Military Standard: Not; Max Power Dissipation: 125mW; Packaging: Cut Tape; Voltage Rating: 100V
R25 = CMP-1011-00001-2: Manufacturer: Yageo / Phycomp; Part Number: RC0402JR-070RL
R26 R27 = CMP-07231-006374-1: Thick Film Chip Resistors 0603 330Ω 0.1W 5% 200ppm/°C; Voltage Rating (DC): 50V; Power Rating: 100mW; Resistance: 330R; Radiation Hardening: No; Case Code (Metric): 1608; Termination: SMD/SMT; Height: 0.45mm; Packaging: Tape and Reel; Construction: Rectangular; Resistor Type: Thick Film; Width: 0.8mm; Military Standard: Not; Package Quantity: 5000; Case Code (Imperial): 0603; REACH SVHC: No SVHC; Contact Plating: Tin; Depth: 0.8mm; Series: CR0603; Max Operating Temperature: 155°C; Mount: Surface Mount; Thickness: 457um; Resistance Tolerance: 5%; Features: Moisture Resistant; Min Operating Temperature: -55°C; Length: 1.6mm; Voltage Rating: 50V; Temperature Coefficient: 200ppm/°C; Case/Package: 0603; Number of Pins: 2; Tolerance: 5%; Max Power Dissipation: 100mW; Number of Terminations: 2
R28 R31-R33 = CMP-2002-00969-2: RES SMD 49.9 OHM 1% 1/10W 0402; Voltage Rating (DC): 50V; Temperature Coefficient: 100ppm/°C; Power Rating: 100mW; Resistance: 49.9R; Resistance Tolerance: 1%; Height: 0.35mm; Lead Free: Lead Free; Construction: Rectangular; Termination: SMD/SMT; Radiation Hardening: No; Military Standard: Not; Max Operating Temperature: 155°C; Packaging: Tape and Reel; Tolerance: 1%; Voltage Rating: 50V; Series: ERJ; Features: Automotive AEC-Q200; Mount: Surface Mount; Case/Package: 0402; Max Power Dissipation: 100mW; Case Code (Metric): 1005; Depth: 0.5mm; Width: 0.02inch; Technology: THICK FILM; Min Operating Temperature: -55°C; Length: 1mm; Resistor Type: Thick Film; Number of Terminations: 2; Contact Plating: Tin; Case Code (Imperial): 0402; RoHS Compliant: Yes; Working Voltage: 50V; Package Quantity: 1
R30 = CMP-1659-00056-1: Chip Resistor, 1 MOhm, +/- 1%, 100 mW, -55 to 155 degC, 0603 (1608 Metric), RoHS, Tape and Reel; Voltage Rating (DC): 25 V; Tolerance: 20%; Case\Package: Radial; Capacitance: 1 mF; Min Operating Temperature: -40 degC; PackageDescription: 2-Pin Surface Mount Device, Body 1.6 x 0.8 mm; ComponentLink1Description: Manufacturer URL; Radiation Hardening: No; DatasheetVersion: Rev. 4, 02/2016; REACH SVHC: No SVHC; Length: 20 mm; Max Operating Temperature: 85 degC; Diameter: 10 mm; Packaging: Bulk; Package Quantity: 200; PackageReference: 0603; Mount: Through Hole; ComponentLink1URL: http://www.yageo.com/; ComponentLink2URL: http://www.yageo.com/documents/recent/PYu-RC_Group_51_RoHS_L_04.pdf; ComponentLink2Description: Datasheet; Width: 0 inch; Lead Pitch: 5 mm; RoHSCompliant: true; Voltage Rating: 25 V; Height: 20 mm
R37 = CMP-1659-00018-2: General Purpose Chip Resistors, 220 Ohm, +/- 1%, -55 to 155 degC, 0603 (1608 Metric), RoHS, Tape and Reel; RoHSCompliant: false; DatasheetVersion: Rev. 4, 04/2009; ComponentLink2Description: Datasheet; ComponentLink2URL: https://datasheet.ciiva.com/11808/0900766b80f96399-11808136.pdf; ComponentLink1URL: http://www.yageo.com/; ComponentLink1Description: Manufacturer URL; PackageReference: 0603; PackageDescription: 2-Pin Surface Mount Device, Body 1.6 x 0.8 mm
R39 = CMP-1011-00632-4: Chip Resistor, 12.1 KOhm, +/- 1%, 63 mW, -55 to 155 degC, 0402 (1005 Metric), RoHS, Tape and Reel; Manufacturer: Basic Passives; PartNumber: CRCW040212K1FKED; Power Rating: 63 mW; Voltage Rating: 50 V; Case\/Package: 0402; Case Code (Metric): 1005; Tolerance: 1%; Length: 1 mm; ComponentLink2URL: http://www.vishay.com/docs/20035/dcrcwe3.pdf; Packaging: Tape and Reel; ComponentLink2Description: Datasheet; RoHSCompliant: true; Pins: 2; ComponentLink1Description: Manufacturer URL; ComponentLink1URL: http://www.vishay.com/; PackageDescription: 2-Pin Surface Mount Device, Body 1 x 0.5 mm; Max Operating Temperature: 155 degC; DatasheetVersion: 06/2012; Weight: 2.3E-05oz; REACH SVHC: Unknown; Package Quantity: 10000; Resistance: 12.1 KOhm; Case Code (Imperial): 0402; Height: 0.35 mm; Radiation Hardening: No; PackageReference: 0402; Min Operating Temperature: -55 degC; Width: 0.5 mm; Mount: Surface Mount; Mounting Technology: Surface Mount
R41 R42 = CMP-2000-00873-2: RES SMD 1K OHM 0.1% 1/10W 0603; Temperature Coefficient: 25ppm/°C; Voltage Rating: 75V; Max Power Dissipation: 100mW; Resistance: 1kR; Technology: METAL FILM; Number of Pins: 2; Packaging: Tape and Reel; Case Code (Imperial): 0603; Case Code (Metric): 1608; Min Operating Temperature: -55°C; REACH SVHC: No SVHC; Length: 1.6mm; Termination: SMD/SMT; Depth: 0.8mm; Resistance Tolerance: 0.1%; Number of Terminations: 2; Width: 0.8mm; Military Standard: Not; Tolerance: 0.1%; Package Quantity: 5000; Contact Plating: Tin; Height: 0.45mm; Construction: Rectangular; Case/Package: 0603; Max Operating Temperature: 155°C; Resistor Type: Thin Film; Series: ERA-3A; Size Code: 0603; RoHS Compliant: Yes; Mount: Surface Mount; Radiation Hardening: No; Power Rating: 100mW
RM2A RM2B RM2C RM2D RM3C RM3D = CMP-2003-04895-2: RES SMD 2.2K OHM 1% 1/4W 1206; Manufacturer: Yageo; Manufacturer Part Number: AC1206FR-072K2L; Voltage Rating: 200V; Value: 2.2KΩ; Tolerance: 0.01; Power Rating: 0.25W; Automotive Grade: Grade 0; Mouser Description: Thick Film Resistors - SMD 1/4W 2.2K ohm 1% AEC-Q200; Automotive: Yes; Ipc Land Pattern Name: RESC310160X55; Category: Res; ComponentLink2URL: http://www.yageo.com/NewPortal/yageodocoutput?fileName=/pdf/R-Chip/PYu-AC_51_RoHS_L_6.pdf; Temperature Range High: +155°C; Composition: Thick Film; Device Class L1: Passive Components; Device Class L3: Chip SMD Resistors; Octopart: https://octopart.com/ac1206fr-072k2l-yageo-23918200; Lead Free: Yes; Device Class L2: Resistors; Footprint Url: http://www.yageo.com/exep/pages/download/literatures/PYu-R_Mount_10.pdf; ComponentLink2Description: Datasheet; Temperature: -55°C to +155°C; Package: AC1206; RoHS: TRUE; Digikey Description: RES SMD 2.2K OHM 1% 1/4W 1206; Resistance: 2.2KΩ; Series: AC; Temperature Range Low: -55°C; Height: 0.65mm
RM3A RM3B = CMP-1014-00546-2: Chip Resistor, 2.2 KOhm, +/- 1%, 250 mW, -55 to 155 degC, 1206 (3216 Metric), RoHS, Tape and Reel; Manufacturer: Yageo; Power Rating: 250mW; Voltage Rating: 200V; Temperature Coefficient: 100ppm/degreesC; RoHSCompliant: true; Packaging: TapeandReel; Termination: SMD/SMT; Case/Package: 1206; Case Code (Imperial): 1206; Manufacturer URL: http://www.yageo.com/; Max Power Dissipation: 250mW; Resistance: 2.2KOhm; Tolerance: 1%; Package Reference: 1206.0; Number of Terminations: 2; Depth: 1.6mm; Case Code (Metric): 3216; Lead Free: LeadFree; REACH SVHC: Unknown; Package Quantity: 1; Datasheet Version: Rev. 5, 10/2016; Length: 3.1mm; Weight: 0.000571oz; Composition: ThickFilm; Width: 0.063inch; Max Operating Temperature: 155degC; Package Description: 2-Pin Surface Mount Device, Body 3.1 x 1.6 mm; Min Operating Temperature: -55degC; Height: 0.55mm; Datasheet URL: http://www.yageo.com/NewPortal/yageodocoutput?fileName=/pdf/R-Chip/PYu-RC_Group_51_RoHS_L_5.pdf; Military Standard: Not
T1 = CMP-0630-00275-2: Digital Transistor (BRT), R1=10 kOhm, R2=47 kOhm, NPN Transistor, 3-Pin SOT-23, Pb-Free, Tape and Reel; Manufacturer: On Semiconductor; R1/R2 Typ: 0.21; V(BR)CEO Min (V): 50; IC Continuous (A): 0.1; hFE Min: 80; ComponentLink1Description: Manufacturer URL; PackageVersion: Rev. AP, 11/2009; ComponentLink2URL: http://www.onsemi.cn/pub_link/Collateral/DTC114Y-D.PDF; ComponentLink2Description: Datasheet; ComponentLink3URL: http://www.onsemi.cn/pub_link/Collateral/318-08.PDF; RoHS: TRUE; Packing: Tape and Reel; PackageDescription: 3-Pin Small Outline Transistor, Body 2.92 x 1.3 mm, Pitch 0.95 mm; ComponentLink1URL: http://www.onsemi.com/; PartNumber: MMUN2214LT1G; DatasheetVersion: Rev. 3; Polarity: NPN; ComponentLink3Description: Package Specification; PackageReference: SOT-23-3-318-08; Mounting Technology: Surface Mount
T? = CMP-03913-28997932-2: 74990111217 Telecom and Datacom Connector, 8 Contact(s), Female, Right Angle, Solder Terminal, Locking; Color: Green, Silver, Yellow; Insertion Loss (dB): -1dB; Number of Contacts: 8; Inductance: 350µH; Direction: Up; Connector Type: RJ45, Socket; Shielding: Shielded; Number of Cores per Jack: 4; Number of Ports: 1; Pitch: 2.54mm; Min Operating Temperature: -40°C; Contact Material: Ferrite, Gold; Mount: Through Hole; Lead Free: Lead Free; Number of Rows: 1; NexarPartId: 28997932; Gender: Female; Number of Positions: 8; Height: 14mm; Housing Material: Thermoplastic; Case/Package: Metal; REACH SVHC: Unknown; Contact Plating: Gold; Max Operating Temperature: 85°C; RoHS: Compliant; Flammability Rating: UL94 V-0; Width: 16mm; Length: 21mm; Termination: Through Hole
TVS1-TVS4 = CMP-0548-00185-2: Transient Voltage Suppressor, 6.40 to 231 V, 30 V Stand-off Voltage, Bi-Directional, -55 to 155 degC, 2-pin DO-214AC, Pb-Free, Tape and Reel; Manufacturer: Vishay Semiconductor; ID (uA): 2; IFSM: 40 A; PPPM (W): 400, 300; VWM (V): 30; VBR Bi-Directional (V): 6.4 to 231; PartNumber: SMAJ30CA-E3/61; Mounting Technology: Surface Mount; Operating Junction and Storage Temperature Range: -55 to 150 degC; ComponentLink1Description: Manufacturer URL; PackageReference: DO-214AC-2; ComponentLink3URL: http://www.vishay.com/docs/88390/smaj50a.pdf; ComponentLink2URL: http://www.vishay.com/docs/88390/smaj50a.pdf; RoHS: TRUE; DatasheetVersion: 12/8/2013; Packing: Tape and Reel; ComponentLink1URL: http://www.vishay.com/; ComponentLink2Description: Datasheet; ComponentLink3Description: Package Specification; PackageDescription: 2-Pin DO-214AC (SMA), Body 4.245 x 2.665 mm
U1 = CMP-04918-000153-1: IC REG BUCK ADJUSTABLE 2A SOT563; Min Output Voltage: 600mV; Max Output Voltage: 5.5V; Synchronous Rectifier: Yes; Min Input Voltage: 2.5V; Number of Outputs: 1; Switching Frequency: 1.5MHz; Output Configuration: Positive; Output Type: Adjustable; Output Current: 2A; Min Operating Temperature: -40°C; Case/Package: SOT-563; Packaging: Tape and Reel; Max Operating Temperature: 125°C; Max Input Voltage: 5.5V; Mount: Surface Mount
U3 = CMP-2000-07454-1: Espressif System, 2.7 to 3.6 V, -40 to 85 degC, 38-Pin SMD; Manufacturer: Olimex; Package Description: 38-Pin Surface Mount Device, Body 18 x 25.5 mm, Pitch 1.27 mm; Manufacturer URL: https://www.olimex.com; RoHSCompliant: false; Mounting Technology: SurfaceMount; Datasheet Version: Rev. 2.1, 09/2017; Datasheet URL: http://www.espressif.com/sites/default/files/documentation/esp-wroom-32_datasheet_en.pdf; Package Reference: ESP-WROOM-32
U4 = CMP-06281-000026-1: IC TRANSCEIVER FULL 4/4 32SQFN; Simplex/Duplex: Full Duplex; Min Operating Temperature: 0°C; Max Operating Temperature: 85°C; Mount: Surface Mount; Packaging: Tray; RoHS Compliant: Yes
U5 = CH340E: USB to serial chip CH340; MF: WCH; SnapEDA_Link: https://www.snapeda.com/parts/CH340E/WCH/view-part/?ref=snap; Package: Package; Value: *; MP: CH340E; Check_prices: https://www.snapeda.com/parts/CH340E/WCH/view-part/?ref=eda